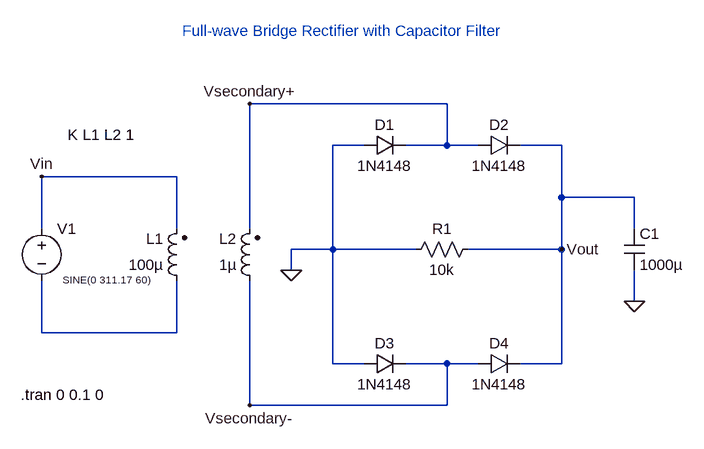
[diagram p0: schematic 2EEB_VELASCO_EXPT3_CKT8.asc]
2EEB_VELASCO_EXPT3_CKT8.asc, the LTspice schematic file:
Version 4
SHEET 1 1060 680
WIRE 688 -112 384 -112
WIRE 560 -48 512 -48
WIRE 688 -48 688 -112
WIRE 688 -48 624 -48
WIRE 736 -48 688 -48
WIRE 864 -48 800 -48
WIRE 272 0 64 0
WIRE 864 32 864 -48
WIRE 976 32 864 32
WIRE 64 80 64 0
WIRE 272 80 272 0
WIRE 384 80 384 -112
WIRE 976 80 976 32
WIRE 512 112 512 -48
WIRE 512 112 448 112
WIRE 640 112 512 112
WIRE 864 112 864 32
WIRE 864 112 720 112
WIRE 448 144 448 112
WIRE 976 192 976 144
WIRE 64 240 64 160
WIRE 272 240 272 160
WIRE 272 240 64 240
WIRE 512 288 512 112
WIRE 560 288 512 288
WIRE 688 288 624 288
WIRE 736 288 688 288
WIRE 864 288 864 112
WIRE 864 288 800 288
WIRE 384 352 384 160
WIRE 688 352 688 288
WIRE 688 352 384 352
FLAG 64 0 Vin
FLAG 448 144 0
FLAG 384 -112 Vsecondary+
FLAG 384 352 Vsecondary-
FLAG 864 112 Vout
FLAG 976 192 0
SYMBOL voltage 64 64 R0
WINDOW 3 99 105 Bottom 1
WINDOW 123 0 0 Left 0
WINDOW 39 99 133 Bottom 1
SYMATTR Value SINE(0 311.17 60)
SYMATTR InstName V1
SYMBOL ind2 288 176 R180
WINDOW 0 36 80 Left 2
WINDOW 3 36 40 Left 2
SYMATTR InstName L1
SYMATTR Value 100µ
SYMATTR SpiceLine Rser=0.001
SYMBOL ind2 400 176 R180
WINDOW 0 36 80 Left 2
WINDOW 3 36 40 Left 2
SYMATTR InstName L2
SYMATTR Value 1µ
SYMATTR Type ind
SYMBOL diode 560 -32 R270
WINDOW 0 32 32 VTop 2
WINDOW 3 0 32 VBottom 2
SYMATTR InstName D1
SYMATTR Value 1N4148
SYMBOL diode 736 -32 R270
WINDOW 0 32 32 VTop 2
WINDOW 3 0 32 VBottom 2
SYMATTR InstName D2
SYMATTR Value 1N4148
SYMBOL diode 560 304 R270
WINDOW 0 32 32 VTop 2
WINDOW 3 0 32 VBottom 2
SYMATTR InstName D3
SYMATTR Value 1N4148
SYMBOL diode 736 304 R270
WINDOW 0 32 32 VTop 2
WINDOW 3 0 32 VBottom 2
SYMATTR InstName D4
SYMATTR Value 1N4148
SYMBOL res 736 96 R90
WINDOW 0 0 56 VBottom 2
WINDOW 3 32 56 VTop 2
SYMATTR InstName R1
SYMATTR Value 10k
SYMBOL cap 960 80 R0
SYMATTR InstName C1
SYMATTR Value 1000µ
TEXT 32 336 Left 2 !.tran 0 0.1 0
TEXT 104 -64 Left 2 !K L1 L2 1
TEXT 280 -224 Left 2 ;Full-wave Bridge Rectifier with Capacitor Filter

The netlist it stands for:
* 2EEB_VELASCO_EXPT3_CKT8.asc
V1 Vin N001 SINE(0 311.17 60)
L1 N001 Vin 100µ Rser=0.001
L2 Vsecondary- Vsecondary+ 1µ
D1 0 Vsecondary+ 1N4148
D2 Vsecondary+ Vout 1N4148
D3 0 Vsecondary- 1N4148
D4 Vsecondary- Vout 1N4148
R1 Vout 0 10k
C1 Vout 0 1000µ
.model D D
.lib standard.dio
.tran 0 0.1 0
K L1 L2 1
* Full-wave Bridge Rectifier with Capacitor Filter
.backanno
.end